# Altium schematic sheet Solution2.SchDoc
size A4
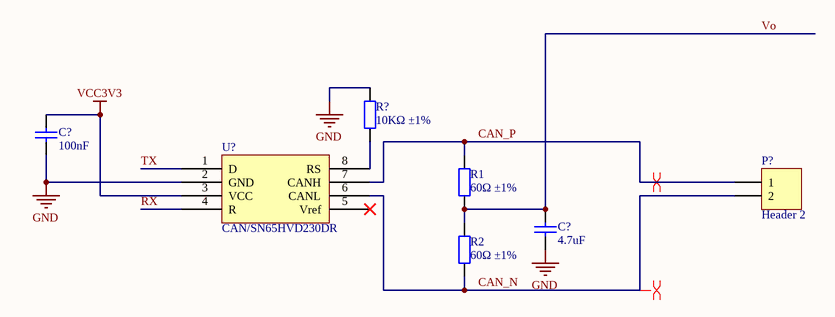
[diagram p0: Solution2.SchDoc]

## Parts
(Parts that share a designator on the sheet are numbered #1, #2 ... from top to bottom, then left to right.)
C?#1  100nF  [0402_C]
C?#2  4.7uF  [0402_C]
P?  Header 2  [HDR1X2]
R1  60Ω ±1%  [0402_R]
R2  60Ω ±1%  [0402_R]
R?  10KΩ ±1%  [0402_R]
U?  CAN/SN65HVD230DR  [SOIC-8_150mil]

## Nets
GND: C?#1.1 C?#2.1 R?.2 U?.2(GND)
VCC3V3: C?#1.2 U?.3(VCC)
CAN_N: P?.2 R2.1 U?.6(CANL)
CAN_P: P?.1 R1.2 U?.7(CANH)
RX: U?.4(R)
TX: U?.1(D)
Vo: C?#2.2 R1.1 R2.2
NetR?_1: R?.1 U?.8(RS)

Not connected (* = marked no-connect by the designer): U? 5(Vref)*

## Layout directives
differential pair: CAN_N, CAN_P

## Library data of the parts
C?#1 = 0402 100nF (104) 10% 16V: Chip capacitors; Manufacturer: Samsung Electro-Mechanics; PartNumber: CL05B104KO5NNNC; Tolerance: 10%; Voltage: 16V; ComponentLink1Description: Supplier link; ComponentLink1URL: http://www.szlcsc.com/product/details_1877.html; Package: 0402; Supplier: LC; SuppliersPartNumber: C1525; Capacitance: 100nF
C?#2 = 0402 4.7uF (475) 20% 10V: Chip capacitor; Manufacturer: Samsung Electro-Mechanics; PartNumber: CL05A475MP5NRNC; Tolerance: 20%; Voltage: 10V; ComponentLink1Description: Supplier link; ComponentLink1URL: http://www.szlcsc.com/product/details_24469.html; Package: 0402; Supplier: LC; SuppliersPartNumber: C23733; Capacitance: 4.7uF
P? = Header 2: Header, 2-Pin; LatestRevisionDate: 17-Jul-2002; LatestRevisionNote: Re-released for DXP Platform.; Publisher: Altium Limited
R1 R2 = 0402 120R (1200) 1%: Chip resistor; Manufacturer: Uniroyal Elec; PartNumber: 0402WGF1200TCE; Power: 1/16W; Resistance: 120Ω; ComponentLink1Description: Supplier link; ComponentLink1URL: http://www.szlcsc.com/product/details_25822.html; Package: 0402; Supplier: LC; SuppliersPartNumber: C25079; Tolerance: 1%
R? = 0402 10K (1002) 1%: Chip resistor; Manufacturer: Uniroyal Elec; PartNumber: 0402WGF1002TCE; Power: 1/16W; ComponentLink1Description: Supplier link; ComponentLink1URL: http://www.szlcsc.com/product/details_26487.html; Package: 0402; Supplier: LC; SuppliersPartNumber: C25744; Resistance: 10KΩ; Tolerance: 1%
U? = CAN/SN65HVD230DR_[C12084]: CAN; ComponentLink1Description: 供应商链接; ComponentLink1URL: http://www.szlcsc.com/product/details_12661.html; Package: SOIC-8_150mil; Supplier: LC; SuppliersPartNumber: C12084